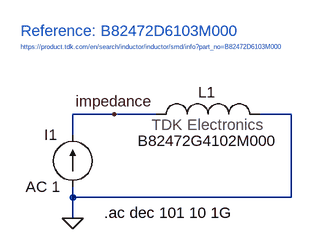
[diagram p0: schematic 04-B82472D6103M000_tdk_model.asc]
04-B82472D6103M000_tdk_model.asc, the LTspice schematic file:
Version 4
SHEET 1 880 680
WIRE 144 112 80 112
WIRE 208 112 144 112
WIRE 416 112 368 112
WIRE 80 144 80 112
WIRE 80 240 80 224
WIRE 416 240 416 112
WIRE 416 240 80 240
WIRE 80 272 80 240
FLAG 80 272 0
FLAG 144 112 impedance
SYMBOL B82472 288 112 R0
WINDOW 0 -15 -34 Left 2
SYMATTR InstName L1
SYMBOL current 80 224 R180
WINDOW 0 24 80 Left 2
WINDOW 3 24 0 Left 2
WINDOW 123 19 0 Left 2
WINDOW 39 0 0 Left 0
SYMATTR InstName I1
SYMATTR Value ""
SYMATTR Value2 AC 1
TEXT 128 264 Left 2 !.ac dec 101 10 1G
TEXT 0 -16 Left 2 ;Reference: B82472D6103M000
TEXT 0 8 Left 0 ;https://product.tdk.com/en/search/inductor/inductor/smd/info?part_no=B82472D6103M000

The netlist it stands for:
* 04-B82472D6103M000_tdk_model.asc
XL1 impedance 0 B82472G4102M000  ; pins A B
I1 0 impedance AC 1
.ac dec 101 10 1G
* Reference: B82472D6103M000
* https://product.tdk.com/en/search/inductor/inductor/smd/info?part_no=B82472D6103M000
.lib B82472.sub
.backanno
.end

* Results of the author's LTspice run, read from the files saved beside the schematic
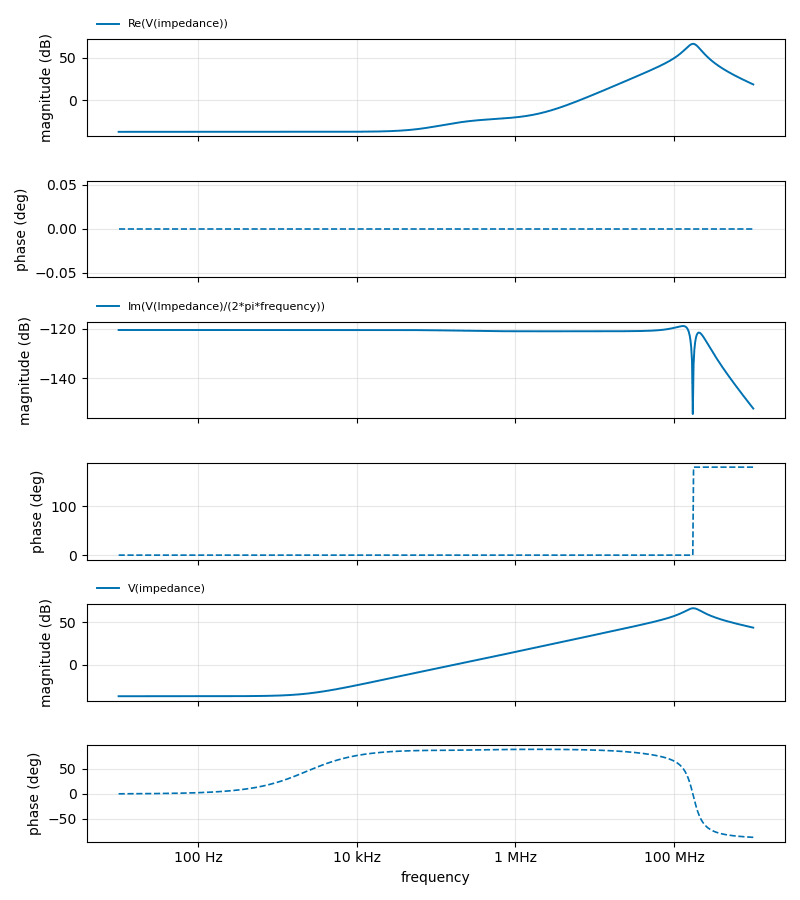
[diagram p1: AC Analysis of 04-B82472D6103M000_tdk_model.asc, plotted from the saved traces]
* AC Analysis, 1 run:
*   Re(V(impedance)): -37.11 dB at 10 Hz, 18.65 dB at 1 GHz, peak 66.42 dB at 172.8 MHz, 3 dB below the peak at 151.8 MHz and 198.8 MHz
*   Im(V(Impedance)/(2*pi*frequency)): -120.42 dB at 10 Hz, -152.39 dB at 1 GHz, peak -118.82 dB at 128.5 MHz, 3 dB below the peak at 155.7 MHz
*   V(impedance): -37.11 dB at 10 Hz, 43.59 dB at 1 GHz, peak 66.44 dB at 176.8 MHz, 3 dB below the peak at 142.2 MHz and 215.4 MHz